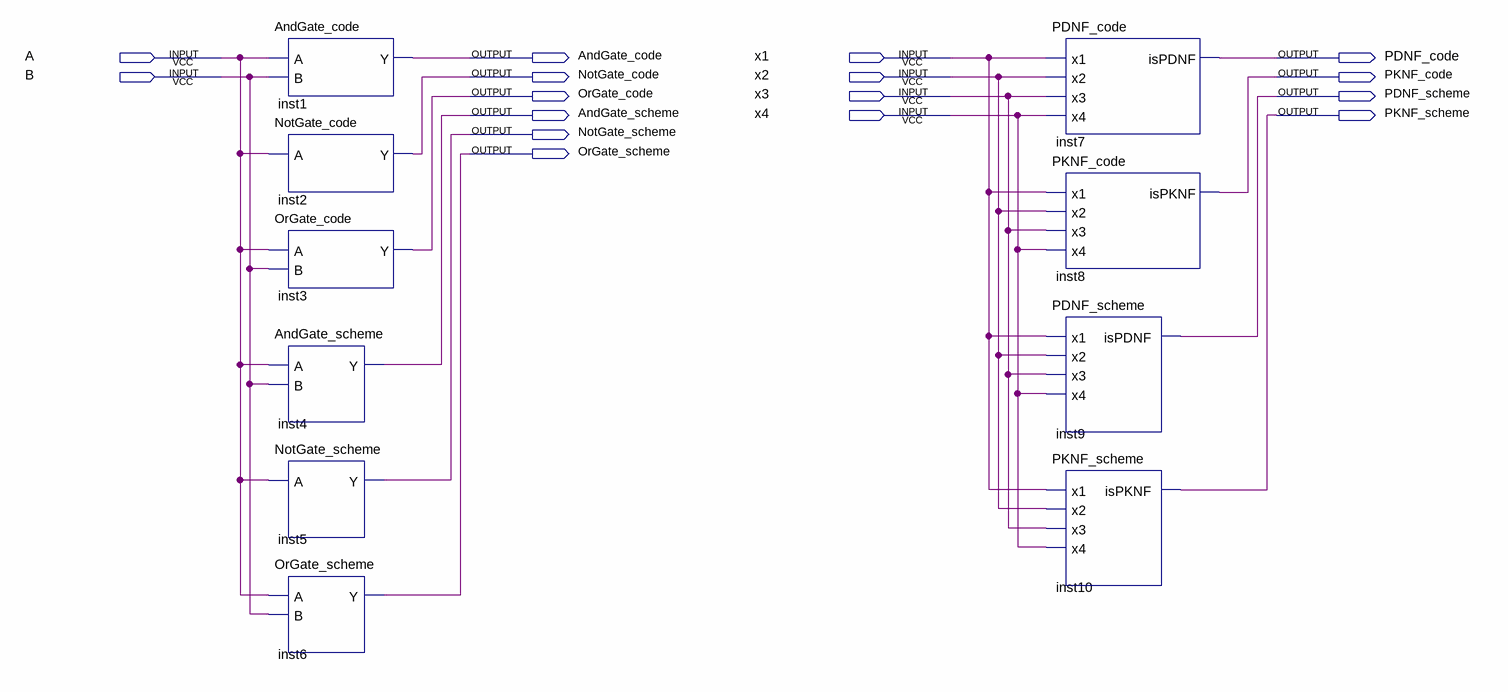
[diagram p0: schematic sheet]
// Quartus schematic coursework.bdf as structural Verilog: 10 symbols, 16 pins
module coursework (
  input  A,
  input  x1,
  input  B,
  input  x2,
  input  x3,
  input  x4,
  output AndGate_code,
  output PDNF_code,
  output NotGate_code,
  output PKNF_code,
  output OrGate_code,
  output PDNF_scheme,
  output AndGate_scheme,
  output PKNF_scheme,
  output NotGate_scheme,
  output OrGate_scheme
);

  AndGate_code inst1 (.A(A), .B(B), .Y(AndGate_code));
  NotGate_code inst2 (.A(A), .Y(NotGate_code));
  OrGate_code inst3 (.A(A), .B(B), .Y(OrGate_code));
  AndGate_scheme inst4 (.A(A), .B(B), .Y(AndGate_scheme));
  NotGate_scheme inst5 (.A(A), .Y(NotGate_scheme));
  OrGate_scheme inst6 (.A(A), .B(B), .Y(OrGate_scheme));
  PDNF_code inst7 (.x1(x1), .x2(x2), .x3(x3), .x4(x4), .isPDNF(PDNF_code));
  PKNF_code inst8 (.x1(x1), .x2(x2), .x3(x3), .x4(x4), .isPKNF(PKNF_code));
  PDNF_scheme inst9 (.x1(x1), .x2(x2), .x3(x3), .x4(x4), .isPDNF(PDNF_scheme));
  PKNF_scheme inst10 (.x1(x1), .x2(x2), .x3(x3), .x4(x4), .isPKNF(PKNF_scheme));
endmodule
